# Altium schematic sheet ADG714_DAC_MUX.SchDoc
size 635 x 241 mm
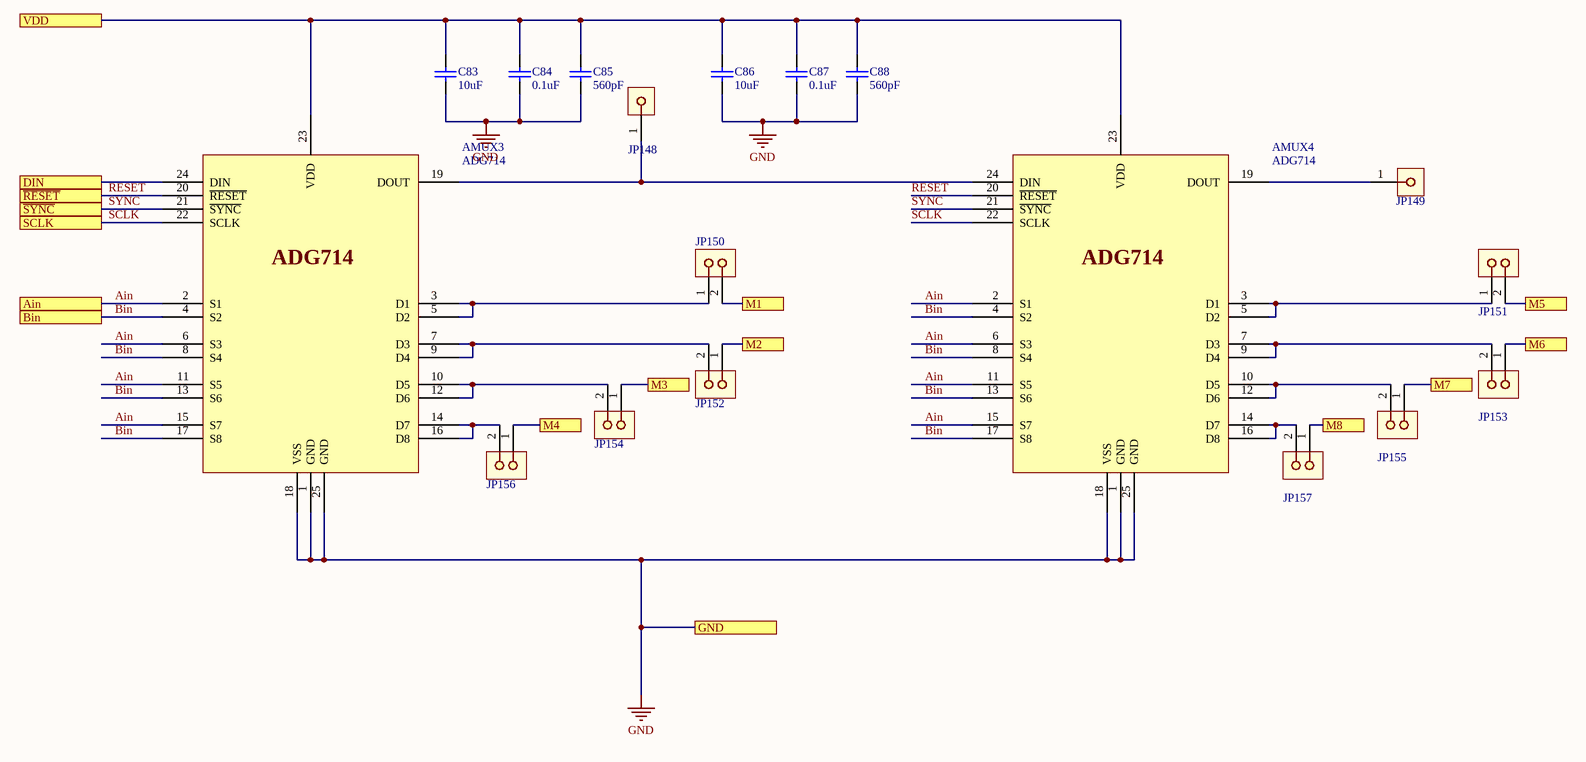
[diagram p0: ADG714_DAC_MUX.SchDoc]

## Parts
AMUX3  ADG714  [ADG714BCPZ]
AMUX4  ADG714  [ADG714BCPZ]
C83  10uF  [C0805]
C84  0.1uF  [C0805]
C85  560pF  [C0805]
C86  10uF  [C0805]
C87  0.1uF  [C0805]
C88  560pF  [C0805]
JP148  01x01  [01x01_0_0.1in_th_straight_b_nom]  (value not drawn)
JP149  01x01  [01x01_0_0.1in_th_straight_b_nom]  (value not drawn)
JP150  01x02  [01x02_0.1in_th_straight_b_nom]  (value not drawn)
JP151  01x02  [01x02_0.1in_th_straight_b_nom]  (value not drawn)
JP152  01x02  [01x02_0.1in_th_straight_b_nom]  (value not drawn)
JP153  01x02  [01x02_0.1in_th_straight_b_nom]  (value not drawn)
JP154  01x02  [01x02_0.1in_th_straight_b_nom]  (value not drawn)
JP155  01x02  [01x02_0.1in_th_straight_b_nom]  (value not drawn)
JP156  01x02  [01x02_0.1in_th_straight_b_nom]  (value not drawn)
JP157  01x02  [01x02_0.1in_th_straight_b_nom]  (value not drawn)

## Ports
Ain, Bin, DIN, GND, M1, M2, M3, M4, M5, M6, M7, M8, SCLK, VDD, ~{RESET}, ~{SYNC}

## Nets
GND: AMUX3.1(GND) AMUX3.18(VSS) AMUX3.25(GND) AMUX4.1(GND) AMUX4.18(VSS) AMUX4.25(GND) C83.1 C84.1 C85.1 C86.1 C87.1 C88.1 ; port GND
Ain: AMUX3.2(S1) AMUX3.6(S3) AMUX3.11(S5) AMUX3.15(S7) AMUX4.2(S1) AMUX4.6(S3) AMUX4.11(S5) AMUX4.15(S7) ; port Ain
Bin: AMUX3.4(S2) AMUX3.8(S4) AMUX3.13(S6) AMUX3.17(S8) AMUX4.4(S2) AMUX4.8(S4) AMUX4.13(S6) AMUX4.17(S8) ; port Bin
DIN: AMUX3.24(DIN) ; port DIN
M1: JP150.2 ; port M1
M2: JP152.1 ; port M2
M3: JP154.1 ; port M3
M4: JP156.1 ; port M4
M5: JP151.2 ; port M5
M6: JP153.1 ; port M6
M7: JP155.1 ; port M7
M8: JP157.1 ; port M8
~{RESET}: AMUX3.20(~{RESET}) AMUX4.20(~{RESET}) ; port ~{RESET}
~{SYNC}: AMUX3.21(~{SYNC}) AMUX4.21(~{SYNC}) ; port ~{SYNC}
SCLK: AMUX3.22(SCLK) AMUX4.22(SCLK) ; port SCLK
VDD: AMUX3.23(VDD) AMUX4.23(VDD) C83.2 C84.2 C85.2 C86.2 C87.2 C88.2 ; port VDD
NetAMUX3_3: AMUX3.3(D1) AMUX3.5(D2) JP150.1
NetAMUX3_7: AMUX3.7(D3) AMUX3.9(D4) JP152.2
NetAMUX3_10: AMUX3.10(D5) AMUX3.12(D6) JP154.2
NetAMUX3_14: AMUX3.14(D7) AMUX3.16(D8) JP156.2
NetAMUX3_19: AMUX3.19(DOUT) AMUX4.24(DIN) JP148.1
NetAMUX4_3: AMUX4.3(D1) AMUX4.5(D2) JP151.1
NetAMUX4_7: AMUX4.7(D3) AMUX4.9(D4) JP153.2
NetAMUX4_10: AMUX4.10(D5) AMUX4.12(D6) JP155.2
NetAMUX4_14: AMUX4.14(D7) AMUX4.16(D8) JP157.2
NetAMUX4_19: AMUX4.19(DOUT) JP149.1

## Library data of the parts
AMUX3 AMUX4 = ADG714: Analog MUX
C83 C86 = Cap 10uF: Manufacturer: Taiyo Yuden; Manufacturer Part Number: UMK212SD103KD-T; Dielectric Material: Ceramic; Capacitance: 10nF; Tolerance: 10%; Voltage Rating: 50V; Supplier 1: Digi-Key; Stock 1: 14125; Pricing 1: 1=0.47, 10=0.323, 100=0.1941, 500=0.1455, 1000=0.1229 (USD); Mount: Surface Mount; Case/Package: 0805; Number of Pins: 2; Case Code (Metric): 2012; Case Code (Imperial): 0805; Min Operating Temperature: -55°C; Max Operating Temperature: 125°C; Packaging: Tape and Reel; Package Quantity: 1; Voltage Rating (DC): 50V; Termination: SMD/SMT; Length: 2mm; Height: 0.85mm; Width: 0.049inch; Thickness: 0.037inch; Depth: 1.25mm; Radiation Hardening: No; Lead Free: Lead Free; Halogen Free: Halogen Free; ComponentLink1URL: https://datasheet.ciiva.com/138/umk212sd103kd-t-ss-138661.pdf; ComponentLink1Description: https://datasheet.ciiva.com/138/umk212sd103kd-t-ss-138661.pdf; ComponentLink2URL: https://datasheet.ciiva.com/138/mlcc07-e-138662.pdf; ComponentLink2Description: https://datasheet.ciiva.com/138/mlcc07-e-138662.pdf; ComponentLink3URL: https://datasheet.ciiva.com/138/mlcc07-e-138663.pdf; ComponentLink3Description: https://datasheet.ciiva.com/138/mlcc07-e-138663.pdf; ComponentLink4URL: https://datasheet.ciiva.com/30140/303umk212sd103kd-t-30140925.pdf; ComponentLink4Description: https://datasheet.ciiva.com/30140/303umk212sd103kd-t-30140925.pdf; Supplier Part Number 1: 587-1114-1-ND
C84 C87 = Cap 0.1uF: Manufacturer: Taiyo Yuden; Manufacturer Part Number: UMK212SD103KD-T; Dielectric Material: Ceramic; Capacitance: 10nF; Tolerance: 10%; Voltage Rating: 50V; Supplier 1: Digi-Key; Stock 1: 14125; Pricing 1: 1=0.47, 10=0.323, 100=0.1941, 500=0.1455, 1000=0.1229 (USD); Mount: Surface Mount; Case/Package: 0805; Number of Pins: 2; Case Code (Metric): 2012; Case Code (Imperial): 0805; Min Operating Temperature: -55°C; Max Operating Temperature: 125°C; Packaging: Tape and Reel; Package Quantity: 1; Voltage Rating (DC): 50V; Termination: SMD/SMT; Length: 2mm; Height: 0.85mm; Width: 0.049inch; Thickness: 0.037inch; Depth: 1.25mm; Radiation Hardening: No; Lead Free: Lead Free; Halogen Free: Halogen Free; ComponentLink1URL: https://datasheet.ciiva.com/138/umk212sd103kd-t-ss-138661.pdf; ComponentLink1Description: https://datasheet.ciiva.com/138/umk212sd103kd-t-ss-138661.pdf; ComponentLink2URL: https://datasheet.ciiva.com/138/mlcc07-e-138662.pdf; ComponentLink2Description: https://datasheet.ciiva.com/138/mlcc07-e-138662.pdf; ComponentLink3URL: https://datasheet.ciiva.com/138/mlcc07-e-138663.pdf; ComponentLink3Description: https://datasheet.ciiva.com/138/mlcc07-e-138663.pdf; ComponentLink4URL: https://datasheet.ciiva.com/30140/303umk212sd103kd-t-30140925.pdf; ComponentLink4Description: https://datasheet.ciiva.com/30140/303umk212sd103kd-t-30140925.pdf; Supplier Part Number 1: 587-1114-1-ND
C85 C88 = Cap 560pF: Manufacturer: Taiyo Yuden; Manufacturer Part Number: UMK212SD103KD-T; Dielectric Material: Ceramic; Capacitance: 10nF; Tolerance: 10%; Voltage Rating: 50V; Stock 1: 14125; Pricing 1: 1=0.47, 10=0.323, 100=0.1941, 500=0.1455, 1000=0.1229 (USD); Mount: Surface Mount; Case/Package: 0805; Number of Pins: 2; Case Code (Metric): 2012; Case Code (Imperial): 0805; Min Operating Temperature: -55°C; Max Operating Temperature: 125°C; Packaging: Tape and Reel; Package Quantity: 1; Voltage Rating (DC): 50V; Termination: SMD/SMT; Length: 2mm; Height: 0.85mm; Width: 0.049inch; Thickness: 0.037inch; Depth: 1.25mm; Radiation Hardening: No; Lead Free: Lead Free; Halogen Free: Halogen Free; ComponentLink1URL: https://datasheet.ciiva.com/138/umk212sd103kd-t-ss-138661.pdf; ComponentLink1Description: https://datasheet.ciiva.com/138/umk212sd103kd-t-ss-138661.pdf; ComponentLink2URL: https://datasheet.ciiva.com/138/mlcc07-e-138662.pdf; ComponentLink2Description: https://datasheet.ciiva.com/138/mlcc07-e-138662.pdf; ComponentLink3URL: https://datasheet.ciiva.com/138/mlcc07-e-138663.pdf; ComponentLink3Description: https://datasheet.ciiva.com/138/mlcc07-e-138663.pdf; ComponentLink4URL: https://datasheet.ciiva.com/30140/303umk212sd103kd-t-30140925.pdf; ComponentLink4Description: https://datasheet.ciiva.com/30140/303umk212sd103kd-t-30140925.pdf; Supplier 1: Digi-Key; Supplier Part Number 1: 311-1120-1-ND
JP148 JP149 = 01x01: 01X01 generic terminal connector
JP150-JP157 = 01x02: 01X02 generic terminal connector